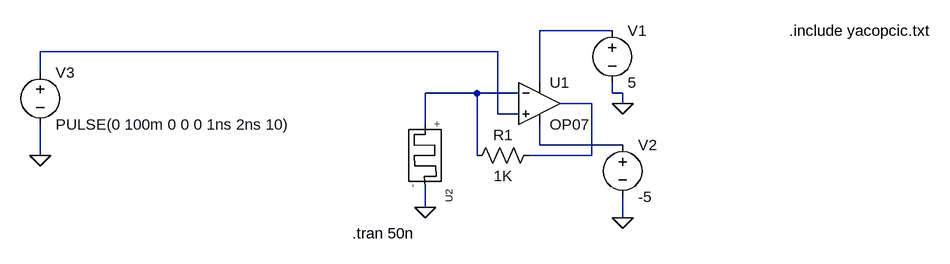
[diagram p0: schematic program_ckt.asc]
program_ckt.asc, the LTspice schematic file:
Version 4
SHEET 1 880 680
WIRE 288 16 176 16
WIRE 112 48 -592 48
WIRE -592 80 -592 48
WIRE 176 96 176 16
WIRE 80 112 0 112
WIRE 144 112 80 112
WIRE 288 112 288 96
WIRE 304 112 288 112
WIRE 256 128 208 128
WIRE 304 128 304 112
WIRE 112 144 112 48
WIRE 144 144 112 144
WIRE 0 160 0 112
WIRE 176 192 176 160
WIRE 304 192 176 192
WIRE -592 208 -592 160
WIRE 80 208 80 112
WIRE 256 208 256 128
WIRE 256 208 160 208
WIRE 0 288 0 256
WIRE 304 304 304 272
FLAG 0 288 0
FLAG 304 128 0
FLAG 304 304 0
FLAG -592 208 0
SYMBOL res 176 192 R90
WINDOW 0 0 56 VBottom 2
WINDOW 3 32 56 VTop 2
SYMATTR InstName R1
SYMATTR Value 1K
SYMBOL memristormodel 0 240 R90
SYMATTR InstName U2
SYMATTR Value MEM_YAKOPCIC
SYMBOL voltage 288 0 R0
WINDOW 123 0 0 Left 2
WINDOW 39 0 0 Left 2
SYMATTR InstName V1
SYMATTR Value 5
SYMBOL voltage 304 176 R0
WINDOW 123 0 0 Left 2
WINDOW 39 0 0 Left 2
SYMATTR InstName V2
SYMATTR Value -5
SYMBOL voltage -592 64 R0
WINDOW 123 0 0 Left 2
WINDOW 39 0 0 Left 2
SYMATTR InstName V3
SYMATTR Value PULSE(0 100m 0 0 0 1ns 2ns 10)
SYMBOL Opamps\\OP07 176 64 R0
SYMATTR InstName U1
TEXT -112 328 Left 2 !.tran 50n
TEXT 560 16 Left 2 !.include yacopcic.txt

The netlist it stands for:
* program_ckt.asc
R1 N004 N003 1K
XU2 N003 0 M MEM_YAKOPCIC  ; pins + -
V1 N001 0 5
V2 N005 0 -5
V3 N002 0 PULSE(0 100m 0 0 0 1ns 2ns 10)
XU1 N002 N003 N001 N005 N004 LT1001  ; OP07, pins In+ In- V+ V- OUT
.tran 50n
.include yacopcic.txt
.lib LTC.lib
.backanno
.end